# EasyEDA Pro project Usb Hub PCB.epro

# Board PCB_PCB_Usbhub_2025-11-17
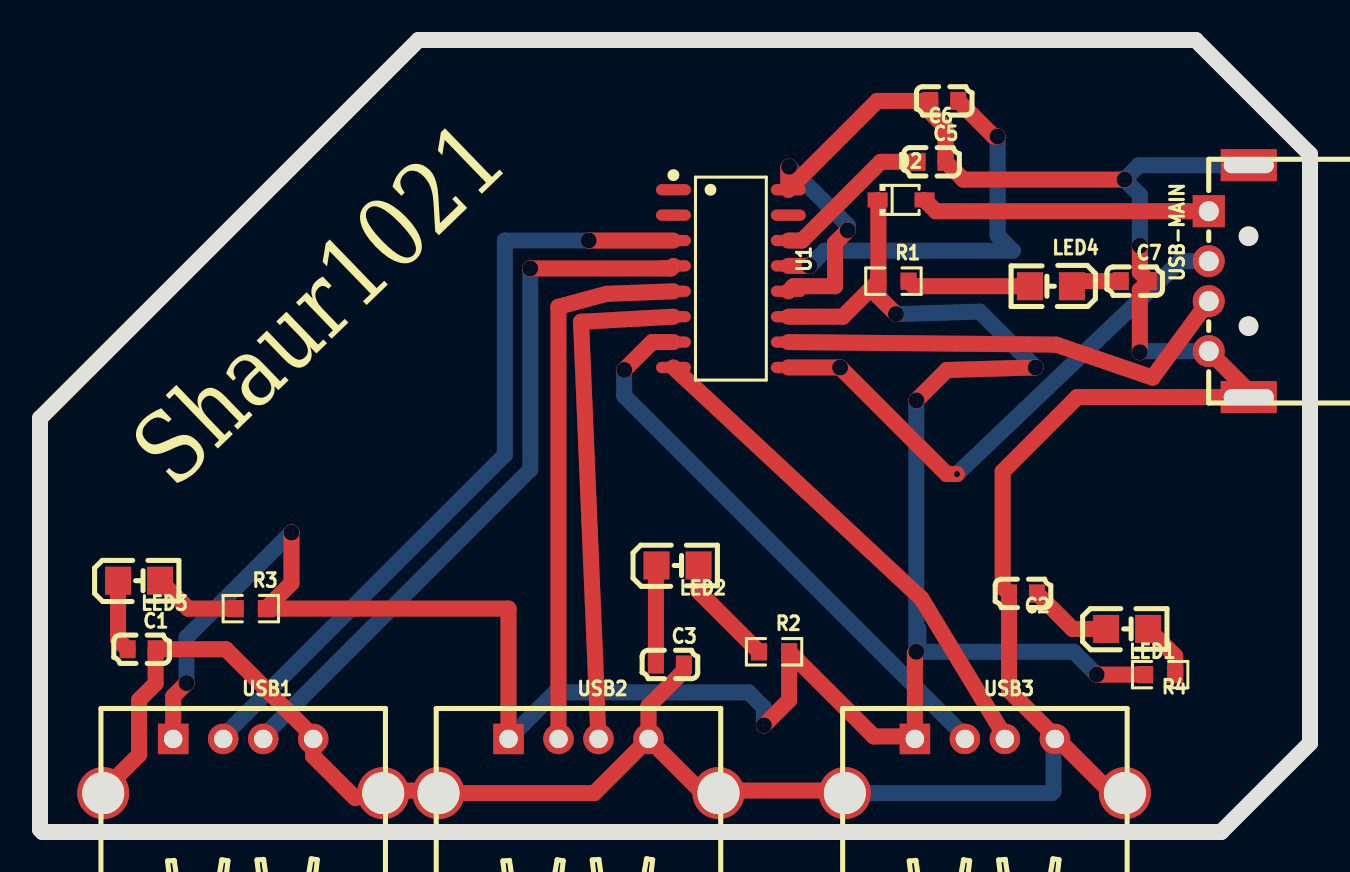
[diagram p0: board, top side]
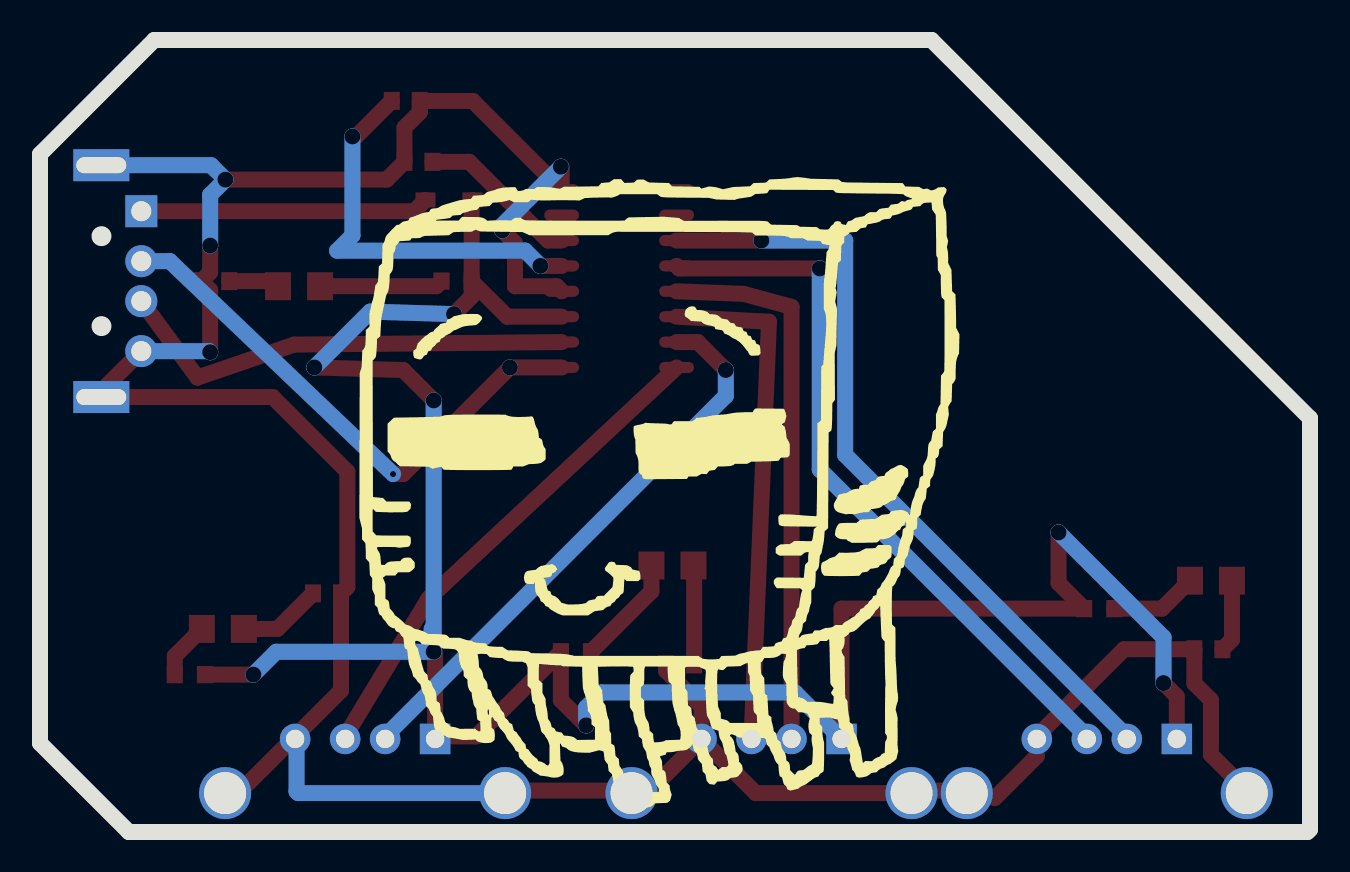
[diagram p1: board, bottom side, seen from below]

Outline 63.5 x 39.62 mm; copper layers: Top Layer, Bottom Layer. Coordinates in mm from the lower left corner of the outline.
Outline path: 0,20.7 0,0.13 0.13,0 59.06,0 63.5,4.44 63.5,33.91 57.78,39.62 18.92,39.62 0,20.7
Stack: Top Layer 0.035mm / Dielectric1 1.51mm FR4 er 4.5 / Bottom Layer 0.035mm

## Design rules (mm)
spacing Default (default): track to track 0.152, other pairs 0 to 0.152
track width Default (default): min 0.254, default 0.254, max 25.4
differential pair differentialPair (default): width min 0.127, default 0.254, max 2.54; gap min 0.152, default 0.152
via Default (default): diameter min 0.61, default 0.61, max 100.025; hole min 0.305, default 0.305, max 59.995

## Placement (name value [footprint] x y rotation side)
C1  10uF  [C0603]  5.08 9.14 0 top
C2  10uF  [C0603]  49.15 11.94 180 top
C3  10uF  [C0603]  31.5 8.38 0 top
C5  10uF  [C0603]  44.58 33.53 0 top
C6  10uF  [C0603]  45.21 36.58 180 top
C7  10uF  [C0603]  54.74 27.56 0 top
D2  NSR0320MW2T1G  [SOD-323_L1.8-W1.3-LS2.5-RD]  43.05 31.62 0 top
LED1  YLED0805G  [LED0805-FD-GREEN]  54.36 10.16 180 top
LED2  YLED0805G  [LED0805-FD-GREEN]  31.88 13.33 180 top
LED3  YLED0805G  [LED0805-FD-GREEN]  4.95 12.57 180 top
LED4  YLED0805G  [LED0805-FD-GREEN]  50.55 27.3 0 top
R1  47Ω  [R0603]  42.67 27.56 0 top
R2  47Ω  [R0603]  36.7 9.02 0 top
R3  47Ω  [R0603]  10.54 11.18 0 top
R4  47Ω  [R0603]  56.01 7.87 180 top
U1  SL2.1A  [SOP-16_L10.0-W3.9-P1.27-LS6.0-BL]  34.54 27.69 270 top
USB1  USB-AF-90-14.4X13.6-H7.0-DIP  [USB-A-TH_C46407]  10.16 3.3 0 top
USB2  USB-AF-90-14.4X13.6-H7.0-DIP  [USB-A-TH_C46407]  26.92 3.3 0 top
USB3  USB-AF-90-14.4X13.6-H7.0-DIP  [USB-A-TH_C46407]  47.24 3.3 0 top
USB-MAIN  U-G-04DD-W-01  [USB-A-TH_U-G-04WD-W-01]  59.44 27.56 90 top

## Footprints (pads in the part's own frame, mm; a bottom-side part is the same pattern mirrored in y, then rotated)
C0603
  rect 0.8x0.9 smd: 1(-0.7,0) 2(0.7,0)
LED0805-FD-GREEN
  rect 1.3x1.399 smd: 1(-1.05,0) 2(1.05,0)
R0603
  rect 0.806x0.864 smd: 1(-0.753,0) 2(0.753,0)
SOD-323_L1.8-W1.3-LS2.5-RD
  rect 1x0.75 smd: 1(-1.173,0) 2(1.173,0)
SOP-16_L10.0-W3.9-P1.27-LS6.0-BL
  oval 0.56x1.745 smd: 1(-4.445,-2.873) 2(-3.175,-2.873) 3(-1.905,-2.873) 4(-0.635,-2.873) 5(0.635,-2.873) 6(1.905,-2.873) 7(3.175,-2.873) 8(4.445,-2.873) 9(4.445,2.873) 10(3.175,2.873) 11(1.905,2.873) 12(0.635,2.873) 13(-0.635,2.873) 14(-1.905,2.873) 15(-3.175,2.873) 16(-4.445,2.873)
USB-A-TH_C46407
  rect 1.524x1.524 hole 0.92: 1(-3.5,1.355)
  round 1.524 hole 0.92: 2(-1,1.355) 3(1,1.355) 4(3.5,1.355)
  round 2.6 hole 2.1: 5(7,-1.355) 6(-7,-1.355)
USB-A-TH_U-G-04WD-W-01
  rect 1.6x1.6 hole 1: 1(3.5,1)
  round 1.6 hole 1: 2(1,1) 3(-1,1) 4(-3.5,1)
  rect 1.6x2.8 hole 0.8x2.5: 5(5.8,-1) 6(-5.8,-1)

## Nets
+5V: D2.1 R1.1 R2.2 R3.2 R4.2 U1.11 USB1.1 USB2.1 USB3.1
GND: C1.2 C2.2 C3.2 C5.2 C6.2 C7.2 U1.12 U1.16 USB1.4 USB1.5 USB1.6 USB2.4 USB2.5 USB2.6 USB3.4 USB3.5 USB3.6 USB-MAIN.4 USB-MAIN.5 USB-MAIN.6
C1_1: C1.1 LED3.2
C2_1: C2.1 LED1.2
C3_1: C3.1 LED2.2
C7_1: C7.1 LED4.2
R1_2: LED4.1 R1.2
R2_1: LED2.1 R2.1
R3_1: LED3.1 R3.1
R4_1: LED1.1 R4.1
U1_3: U1.3 USB1.2
U1_4: U1.4 USB1.3
U1_13: C6.1 U1.13
U1_14: C5.1 U1.14
USB2_2: U1.5 USB2.2
USB2_3: U1.6 USB2.3
USB3_2: U1.7 USB3.2
USB3_3: U1.8 USB3.3
USB-MAIN_1: D2.2 USB-MAIN.1
USB-MAIN_2: U1.9 USB-MAIN.2
USB-MAIN_3: U1.10 USB-MAIN.3

Pads without a net: U1 1 2 15

## Via types
v1: diameter 0.8, hole 0.8, Top Layer to Bottom Layer, 19 vias
v2: diameter 0.62, hole 0.31, Top Layer to Bottom Layer, 1 via

## Routing (per net, layer and track width the routed paths; a pad name or vN(x,y) marks a point on that pad's centre or on a via; arc(x,y) is an arc through that point)
+5V: length 119
  Top Layer w0.8: v1(43.81,21.59) 45.34,23.11 v1(49.78,23.24) ; v1(42.8,25.91) 41.92,26.79 R1.1 ; D2.1 41.92,31.58 R1.1 ; v1(12.57,14.99) 12.57,12.45 R3.2 ; v1(43.81,9.02) 43.74,8.95 USB3.1 ; R1.1 40.14,25.78 U1.11 ; 6.66,4.78 6.66,6.79 v1(7.33,7.45) ; v1(36.19,5.33) 37.46,6.6 R2.2 41.69,4.78 43.74,4.78 ; R4.2 v1(52.83,7.87) ; 11.3,11.18 23.42,11.18 23.42,4.66
  Bottom Layer w0.8: v1(43.81,9.02) v1(43.81,21.59) ; v1(43.81,9.02) 51.69,9.02 v1(52.83,7.87) ; v1(43.81,9.02) 43.92,9.12 43.92,10.16 ; v1(12.57,14.99) 7.33,9.74 v1(7.33,7.45) ; USB2.1 25.75,6.98 35.43,6.98 36.19,6.22 v1(36.19,5.33) ; v1(42.8,25.91) 46.99,26.03 v1(49.78,23.24)
GND: length 153.1
  Top Layer w0.254: 58.44,23.76 USB-MAIN.4
  Top Layer w0.8: v1(54.99,29.34) 54.99,28 C7.2 54.99,27.11 v1(54.99,24) ; v1(37.46,33.28) 37.42,33.24 U1.16 41.86,36.58 C6.2 44.51,36.01 45.28,35.24 45.28,33.53 ; v1(54.23,32.64) 46.17,32.64 C5.2 ; USB2.4 33.13,1.95 USB2.5 34.05,2.07 40.24,2.07 ; USB2.4 30.42,6.29 32.2,8.07 C3.2 ; USB2.4 27.71,1.95 USB2.6 19.8,2.07 17.16,2.07 ; 15.76,1.69 13.66,3.8 13.66,4.78 9.3,9.14 C1.2 5.78,7.43 4.95,6.6 4.95,3.87 3.16,2.07 ; USB3.5 53.58,1.95 50.74,4.78 48.45,7.08 C2.2 48.13,12.25 48.13,18.03 51.86,21.76 USB-MAIN.6 60.44,22.06 USB-MAIN.4 ; U1.12 37.67,27.3 39.75,27.3 39.75,29.46 v1(40.39,30.1)
  Bottom Layer w0.8: v1(54.99,24) 55.05,24.06 USB-MAIN.4 ; USB3.4 50.67,4.59 50.67,2.03 50.59,1.95 USB3.6 ; v1(54.99,29.34) 54.99,31.88 v1(54.23,32.64) 54.95,33.36 USB-MAIN.5 ; v1(40.39,30.1) 40.39,30.35 v1(37.46,33.28)
C1_1: length 3.6
  Top Layer w0.8: C1.1 3.9,9.62 LED3.2
C2_1: length 4.2
  Top Layer w0.8: LED1.2 51.63,10.16 C2.1
C3_1: length 5
  Top Layer w0.8: LED2.2 30.8,13.3 C3.1
C7_1: length 2.5
  Top Layer w0.8: LED4.2 51.85,27.56 C7.1
R1_2: length 6.2
  Top Layer w0.8: LED4.1 43.68,27.3 R1.2
R2_1: length 5.6
  Top Layer w0.8: R2.1 32.93,12.04 LED2.1
R3_1: length 4.4
  Top Layer w0.8: LED3.1 7.4,11.18 R3.1
R4_1: length 2.8
  Top Layer w0.8: LED1.1 56.76,8.81 R4.1
U1_3: length 39.1
  Top Layer w0.8: v1(27.43,29.59) U1.3
  Bottom Layer w0.8: 9.16,4.78 23.24,18.86 23.24,29.59 v1(27.43,29.59)
U1_4: length 36.2
  Top Layer w0.8: U1.4 31.54,28.19 v1(24.51,28.19)
  Bottom Layer w0.8: 11.16,4.78 24.51,18.14 v1(24.51,28.19)
U1_13: length 20.3
  Top Layer w0.8: v1(47.88,34.8) 47.69,34.8 C6.1 ; U1.13 v1(38.48,28.32)
  Bottom Layer w0.8: v1(47.88,34.8) 47.88,29.84 48.64,29.08 39.24,29.08 v1(38.48,28.32)
U1_14: length 8.1
  Top Layer w0.8: C5.1 42.04,33.53 38.1,29.59 U1.14
USB2_2: length 27.7
  Top Layer w0.8: U1.5 28.32,26.92 25.92,26.27 25.92,4.66 26.08,4.82
USB2_3: length 25.5
  Top Layer w0.8: U1.6 27.05,25.53 27.93,4.66
USB3_2: length 28.4
  Top Layer w0.8: v1(29.21,23.11) 30.61,24.51 U1.7
  Bottom Layer w0.8: 46.24,4.78 29.21,21.82 v1(29.21,23.11)
USB3_3: length 25
  Top Layer w0.8: 48.25,4.78 44.07,11.68 U1.8
USB-MAIN_1: length 14.4
  Top Layer w0.8: D2.2 44.79,31.06 USB-MAIN.1
USB-MAIN_2: length 27.5
  Top Layer w0.8: U1.9 v1(40,23.24) 45.34,17.91 v2(45.85,17.91)
  Bottom Layer w0.8: v2(45.85,17.91) 57.01,28.56 USB-MAIN.2
USB-MAIN_3: length 23.2
  Top Layer w0.8: U1.10 50.8,24.38 55.63,22.73 USB-MAIN.3

## Text on the board
Top Silkscreen Layer: Shaur1021
